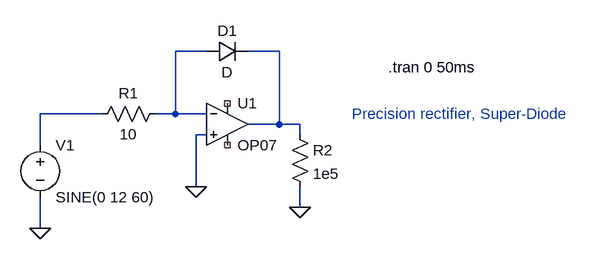
[diagram p0: schematic precision_rectifier.asc]
precision_rectifier.asc, the LTspice schematic file:
Version 4
SHEET 1 940 680
WIRE 384 176 336 176
WIRE 496 176 448 176
WIRE 224 272 128 272
WIRE 336 272 336 176
WIRE 336 272 304 272
WIRE 384 272 336 272
WIRE 496 288 496 176
WIRE 496 288 448 288
WIRE 528 288 496 288
WIRE 384 304 368 304
WIRE 528 304 528 288
WIRE 128 320 128 272
WIRE 368 384 368 304
WIRE 528 416 528 384
WIRE 128 448 128 400
FLAG 128 448 0
FLAG 368 384 0
FLAG 528 416 0
SYMBOL OpAmps/OP07 416 224 R0
SYMATTR InstName U1
SYMBOL Diode 384 192 R270
WINDOW 0 32 32 VTop 2
WINDOW 3 0 32 VBottom 2
SYMATTR InstName D1
SYMBOL Voltage 128 304 R0
SYMATTR InstName V1
SYMATTR Value SINE(0 12 60)
SYMBOL Res 320 256 R90
WINDOW 0 0 56 VBottom 2
WINDOW 3 32 56 VTop 2
SYMATTR InstName R1
SYMATTR Value 10
SYMBOL Res 512 288 R0
SYMATTR InstName R2
SYMATTR Value 1e5
TEXT 664 200 Left 2 !.tran 0 50ms
TEXT 608 272 Left 2 ;Precision rectifier, Super-Diode

The netlist it stands for:
* precision_rectifier.asc
XU1 0 N001 NC_01 NC_02 N002 LT1001  ; OP07, pins In+ In- V+ V- OUT
D1 N001 N002 D
V1 N003 0 SINE(0 12 60)
R1 N001 N003 10
R2 N002 0 1e5
.model D D
.lib standard.dio
.tran 0 50ms
* Precision rectifier, Super-Diode
.lib LTC.lib
.backanno
.end